# EAGLE design pico_test_w5100s_evb (EAGLE 9.6.2)
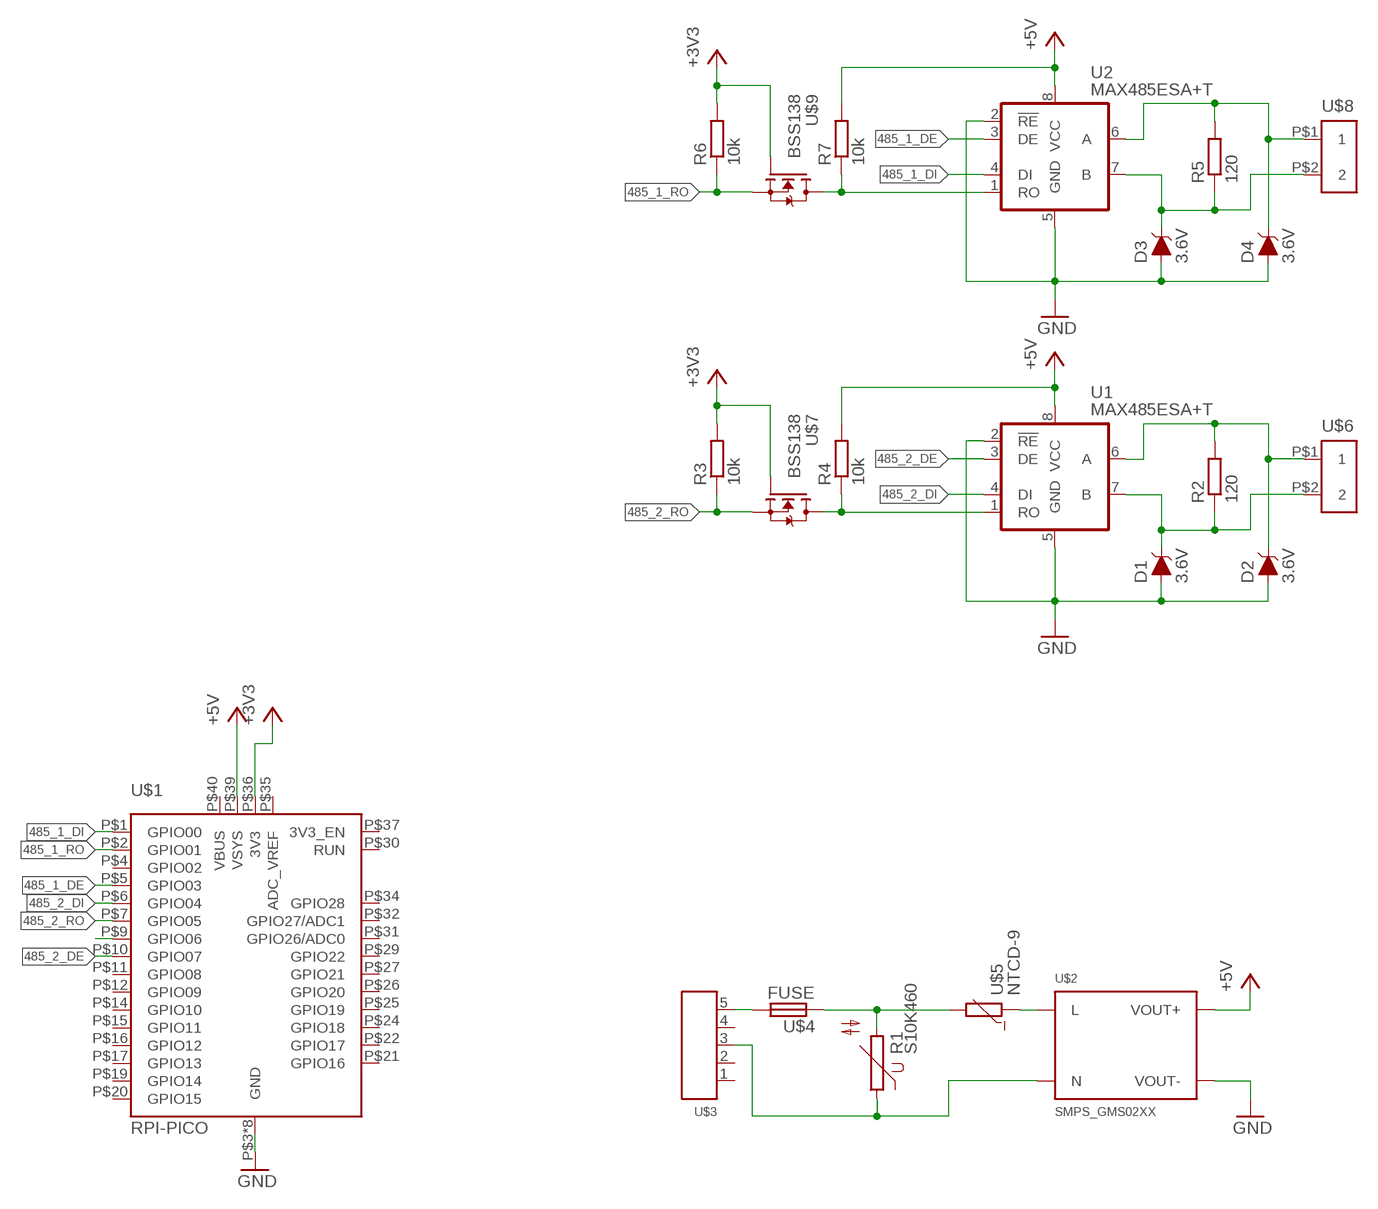
[diagram p0: schematic, sheet 1]

## Parts
D1  3.6V  DIODE-ZENER-BZT52C3V6S  [SOD-323]
D2  3.6V  DIODE-ZENER-BZT52C3V6S  [SOD-323]
D3  3.6V  DIODE-ZENER-BZT52C3V6S  [SOD-323]
D4  3.6V  DIODE-ZENER-BZT52C3V6S  [SOD-323]
R1  S10K460  [S10K460]
R2  120  R-EU_R0603  [R0603]
R3  10k  R-EU_R0603  [R0603]
R4  10k  R-EU_R0603  [R0603]
R5  120  R-EU_R0603  [R0603]
R6  10k  R-EU_R0603  [R0603]
R7  10k  R-EU_R0603  [R0603]
U1  MAX485ESA+T  [SOIC127P600X175-8N]
U2  MAX485ESA+T  [SOIC127P600X175-8N]
U$1  RPI-PICO  [W5100S-EVB-PICO]
U$2  SMPS_GMS02XX  [GMS02XX]
U$3  XEHDR-5  [XEHDR-5]
U$4  FUSE  [FUZEX8.5X4.5X5.08]
U$5  NTCD-9  [NTCXD-9]
U$6  XEHDR-2  [5EHDR-2]
U$7  BSS138  [SOT95P240X110-3N]
U$8  XEHDR-2  [5EHDR-2]
U$9  BSS138  [SOT95P240X110-3N]

## Nets
485_1_DE: U2.3(DE) U$1.P$5(GPIO03)
485_1_DI: U2.4(DI) U$1.P$1(GPIO00)
485_1_RO: R6.1 U$1.P$2(GPIO01) U$9.2(S)
485_2_DE: U1.3(DE) U$1.P$10(GPIO07)
485_2_DI: U1.4(DI) U$1.P$6(GPIO04)
485_2_RO: R3.1 U$1.P$7(GPIO05) U$7.2(S)
+3V3: R3.2 R6.2 U$1.P$36(3V3) U$7.1(G) U$9.1(G)
+5V: R4.2 R7.2 U1.8(VCC) U2.8(VCC) U$1.P$39(VSYS) U$2.DC+(VOUT+)
GND: D1.A D2.A D3.A D4.A U1.2(!RE) U1.5(GND) U2.2(!RE) U2.5(GND) U$1.P$3(GND) U$1.P$8(GND) U$1.P$13(GND) U$1.P$18(GND) U$1.P$23(GND) U$1.P$28(GND) U$1.P$33(GND) U$1.P$38(GND) U$2.DC-(VOUT-)
N$1: U$3.5 U$4.P$2
N$2: R1.2 U$4.P$1 U$5.P$2
N$3: U$2.P$1(L) U$5.P$1
N$4: R1.1 U$2.P$2(N) U$3.3
N$5: R4.1 U1.1(RO) U$7.3(D)
N$6: D1.C R2.1 U1.7(B) U$6.P$2
N$7: D2.C R2.2 U1.6(A) U$6.P$1
N$10: D3.C R5.1 U2.7(B) U$8.P$2
N$11: D4.C R5.2 U2.6(A) U$8.P$1
N$15: U$1.P$9(GPIO06)
N$17: R7.1 U2.1(RO) U$9.3(D)
Unconnected: U$1.P$4(GPIO02) U$1.P$11(GPIO08) U$1.P$12(GPIO09) U$1.P$14(GPIO10) U$1.P$15(GPIO11) U$1.P$16(GPIO12) U$1.P$17(GPIO13) U$1.P$19(GPIO14) U$1.P$20(GPIO15) U$1.P$21(GPIO16) U$1.P$22(GPIO17) U$1.P$24(GPIO18) U$1.P$25(GPIO19) U$1.P$26(GPIO20) U$1.P$27(GPIO21) U$1.P$29(GPIO22) U$1.P$30(RUN) U$1.P$31(GPIO26/ADC0) U$1.P$32(GPIO27/ADC1) U$1.P$34(GPIO28) U$1.P$35(ADC_VREF) U$1.P$37(3V3_EN) U$1.P$40(VBUS) U$3.1 U$3.2 U$3.4

## Library data of the parts
D1-D4 = picoRS485Gateway:DIODE-ZENER: Zener Diode A Zener diode allows current to flow from its anode to its cathode like a normal semiconductor diode, but it also permits current to flow in the reverse direction when its "Zener voltage" is reached. - WIkipedia; PROD_ID: DIO-08199
R1 = picoRS485Gateway:S10K460: VARISTOR
R2-R7 = rcl:R-EU_: RESISTOR, European symbol; SPICEPREFIX: R
U1 U2 = picoRS485Gateway:MAX485ESA+T: Check prices <https://pricing.snapeda.com/parts/MAX485ESA%2BT/Maxim%20Integrated/view-part?ref=eda>; AVAILABILITY: Not in stock; DESCRIPTION: 1/1 Transceiver Half RS422, RS485 8-SOIC; MF: Maxim Integrated; MP: MAX485ESA+T; PACKAGE: SOIC-8 Maxim; PRICE: None
U$1 = picoRS485Gateway:RPI-PICO
U$2 = picoRS485Gateway:SMPS_GMS
U$3 = picoRS485Gateway:XEHDR-5
U$4 = picoRS485Gateway:FUSE
U$5 = picoRS485Gateway:NTC
U$6 U$8 = picoRS485Gateway:XEHDR-2
U$7 U$9 = picoRS485Gateway:BSS138

## Board
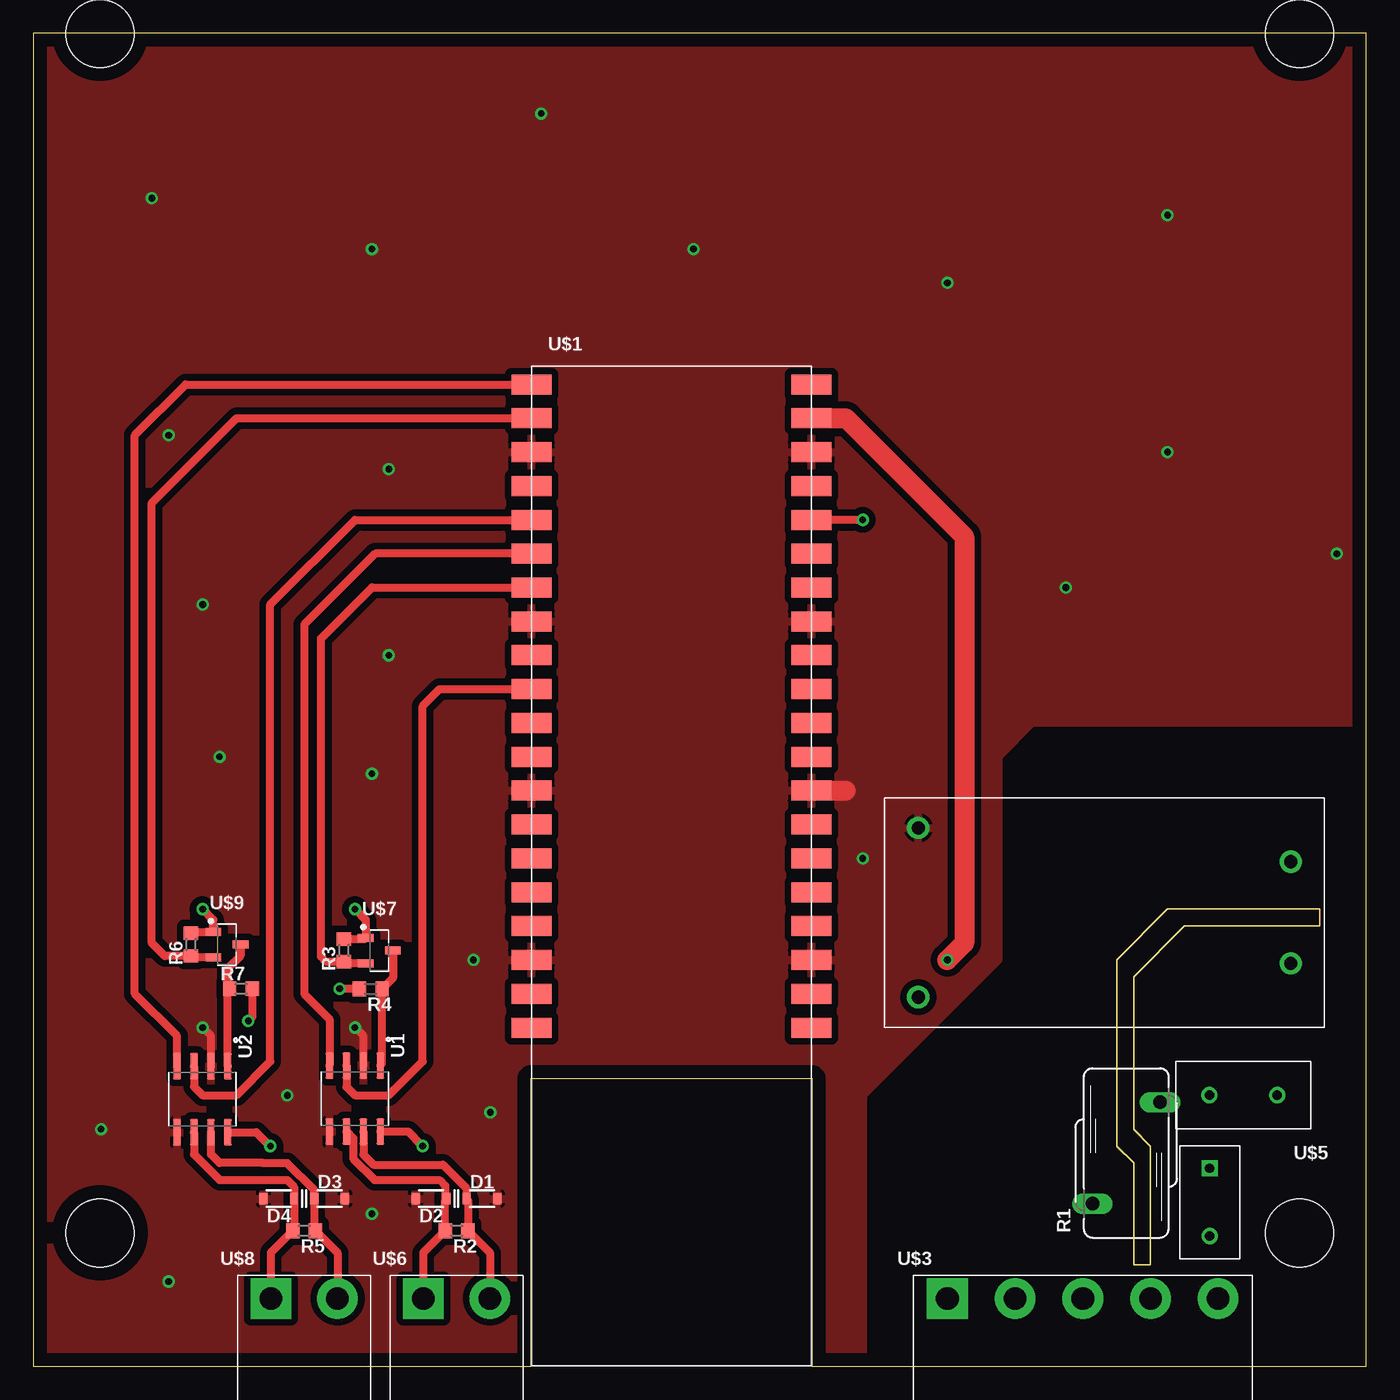
[diagram p1: board, top side]
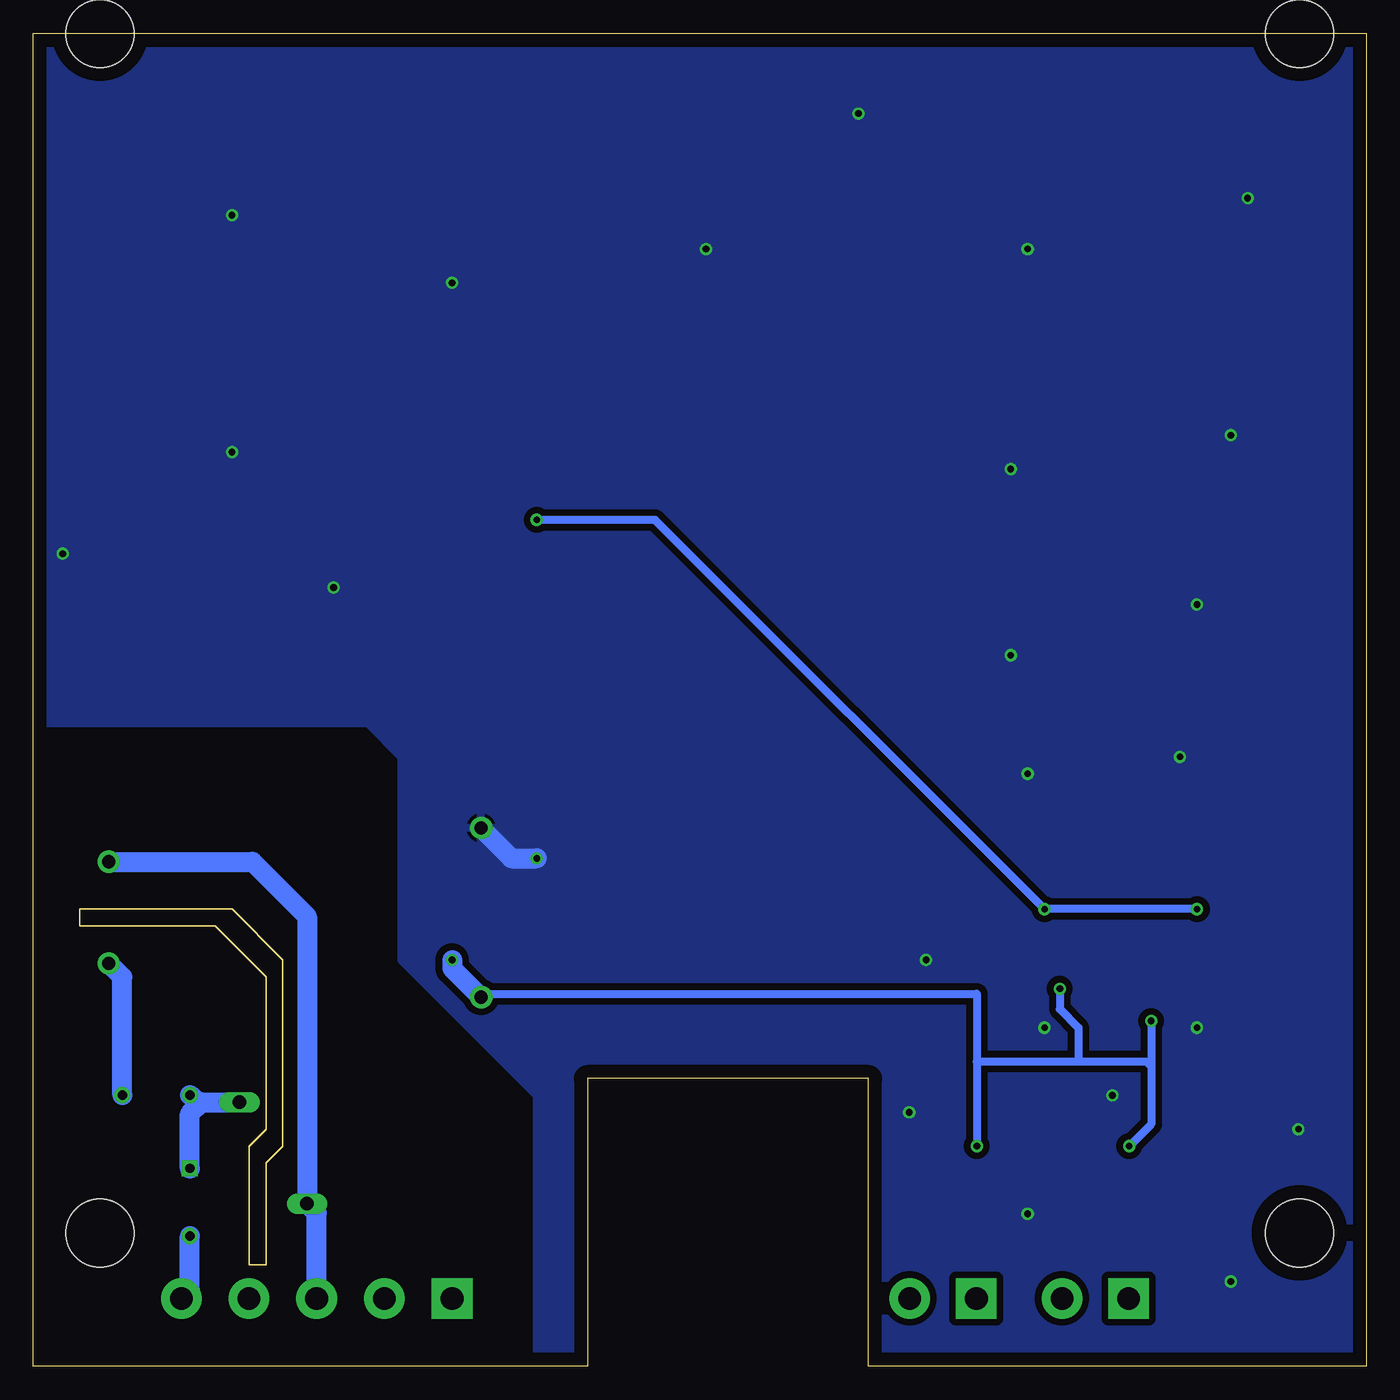
[diagram p2: board, bottom side, seen from below]

Size 100 x 100 mm. Coordinates in mm from the lower left corner, seen from the top.
Outline: 0,0 37.34,0 37.34,21.59 58.42,21.59 58.42,0 100,0 100,100 0,100 0,0
Copper layers (1*16): Top 0.035mm / dielectric 0.15mm / Bottom 0.035mm
Design rules "default": minimum track width 6mil, minimum drill 0.35mm, track to track 6mil, track to pad 6mil, pad to pad 6mil, via to via 6mil, smd to smd 6mil, copper to edge 40mil, drill to drill 6mil, minimum pad ring 10mil, minimum via ring 8mil, stop-mask expansion 4mil, vias tented up to drill 0mil, thermal gap 10mil
Holes 5.1 mm at 5,10 95,10 95,100 5,100
Milling: 12 lines

### Footprints (pad centres in the part's own frame; a part is rotated, then mirrored left to right if it is on the bottom)
SOD-323 = smd 0.63 x 0.83: A 1.15,0; C -1.15,0
S10K460 = drill 1.016 long: 1 -2.54,-3.81; 2 2.54,3.81
R0603 = smd 1 x 1.1: 1 -0.85,0; 2 0.85,0
SOIC127P600X175-8N = smd 1.97 x 0.59: 1 -2.475,1.905; 2 -2.475,0.635; 3 -2.475,-0.635; 4 -2.475,-1.905; 5 2.475,-1.905; 6 2.475,-0.635; 7 2.475,0.635; 8 2.475,1.905
W5100S-EVB-PICO = smd 1.5 x 3: P$1 0,0; P$2 2.54,0; P$3 5.08,0; P$4 7.62,0; P$5 10.16,0; P$6 12.7,0; P$7 15.24,0; P$8 17.78,0; P$9 20.32,0; P$10 22.86,0; P$11 25.4,0; P$12 27.94,0; P$13 30.48,0; P$14 33.02,0; P$15 35.56,0; P$16 38.1,0; P$17 40.64,0; P$18 43.18,0; P$19 45.72,0; P$20 48.26,0; P$21 48.26,21; P$22 45.72,21; P$23 43.18,21; P$24 40.64,21; P$25 38.1,21; P$26 35.56,21; P$27 33.02,21; P$28 30.48,21; P$29 27.94,21; P$30 25.4,21; P$31 22.86,21; P$32 20.32,21; P$33 17.78,21; P$34 15.24,21; P$35 12.7,21; P$36 10.16,21; P$37 7.62,21; P$38 5.08,21; P$39 2.54,21; P$40 0,21
GMS02XX = drill 1 pad 1.676: DC+ 30.47,14.95; DC- 30.47,2.25; P$1 2.53,12.41; P$2 2.53,4.79
XEHDR-5 = drill 1.7 pad 3.048 square: 1 -10.16,5.08 | drill 1.7 pad 3.048: 2 -5.08,5.08; 3 0,5.08; 4 5.08,5.08; 5 10.16,5.08
FUZEX8.5X4.5X5.08 = drill 0.7 square: P$1 -2.54,0 | drill 0.7: P$2 2.54,0
NTCXD-9 = drill 0.7: P$1 -2.54,0; P$2 2.54,0
5EHDR-2 = drill 1.7 pad 3.048 square: P$1 -2.5,0 | drill 1.7 pad 3.048: P$2 2.5,0
SOT95P240X110-3N = smd 1.18 x 0.609: 1 -1.024,0.95; 2 -1.024,-0.95; 3 1.024,0

### Placement (x,y rotation side)
D1  33.66,12.57 0 top
D2  29.84,12.57 180 top
D3  22.23,12.57 0 top
D4  18.41,12.57 180 top
R1  82,16 0 top
R2  31.75,10.16 180 top
R3  23.3,31.2 90 top
R4  25.32,28.3 180 top
R5  20.32,10.16 180 top
R6  11.84,31.63 90 top
R7  15.58,28.31 0 top
U1  24.13,20.08 270 top
U2  12.69,20.03 270 top
U$1  37.37,73.66 270 top
U$2  96.87,42.63 180 top
U$3  78.74,0 0 top
U$4  88.26,12.3 270 top
U$5  90.78,20.34 180 top
U$6  31.75,5.08 0 top
U$7  25.96,31.18 0 top
U$8  20.32,5.08 0 top
U$9  14.53,31.63 0 top

### Tracks (layer width: path | path; a pad name or v marks a point on that pad's centre or on a via)
485_1_DE
  Top 0.61: U2.3 12.05,20.96 12.7,20.32 15.24,20.32 17.78,22.86 17.78,57.15 24.13,63.5 U$1.P$5
485_1_DI
  Top 0.61: U$1.P$1 11.43,73.66 7.62,69.85 7.62,27.94 10.79,24.77 U2.4
485_1_RO
  Top 0.61: U$9.2 11.93,30.68 R6.1 9.86,30.78 8.89,31.75 8.89,64.77 15.24,71.12 U$1.P$2
485_2_DE
  Top 0.61: U1.3 23.5,20.95 24.13,20.32 26.67,20.32 29.21,22.86 29.21,49.53 30.48,50.8 U$1.P$10
485_2_DI
  Top 0.61: U$1.P$6 25.65,60.96 20.32,55.63 20.32,27.94 22.23,26.04 U1.4
485_2_RO
  Top 0.61: U$7.2 23.42,30.23 R3.1 21.98,30.35 21.59,30.73 21.59,54.61 25.4,58.42 U$1.P$7
+3V3  (via drill 0.5)
  Top 0.61: 23.38,32.13 R3.2 24.86,32.05 U$7.1 24.94,33.48 v24.13,34.29 | R6.2 11.94,32.58 U$9.1 13.51,33.48 v12.7,34.29 | v62.23,63.5 U$1.P$36
  Bottom 0.61: v12.7,34.29 v24.13,34.29 53.34,63.5 v62.23,63.5
+5V  (via drill 0.5)
  Top 0.61: U2.8 16.73,17.55 v17.78,16.51 | R7.2 16.43,26.21 v16.13,25.91 | R4.2 23.01,28.3 v22.99,28.32 | U1.8 28.11,17.61 v29.21,16.51
  Top 1.5: U$1.P$39 60.96,71.12 69.85,62.23 69.85,31.75 v68.58,30.48
  Bottom 0.61: U$2.DC+ 66.14,27.94 29.21,27.94 29.21,22.86 | 29.21,22.86 21.59,22.86 | 21.59,22.86 16.51,22.86 16.13,22.48 | 16.13,22.48 16.13,18.16 v17.78,16.51 | v16.13,25.91 16.13,22.48 | v22.99,28.32 22.99,26.8 21.59,25.4 21.59,22.86 | 29.21,22.86 v29.21,16.51
  Bottom 1.5: v68.58,30.48 68.58,29.86 U$2.DC+
GND  (via drill 0.5)
  Top 0.61: U2.2 13.32,24.77 v12.7,25.4 | U1.2 24.77,24.77 v24.13,25.4
  Top 1.5: U$1.P$28 60.96,43.18 | 36.83,43.18 U$1.P$13
  Bottom 1.5: U$2.DC- 64.12,38.1 v62.23,38.1
  other vias: 25.4,83.82 49.53,83.82 68.58,81.28 77.47,58.42 26.67,53.34 26.67,67.31 12.7,57.15 5.08,17.78 10.16,6.35 85.09,86.36 97.79,60.96 85.09,68.58 38.1,93.98 8.89,87.63 25.4,44.45 13.97,45.72 19.05,20.32 25.4,11.43 34.29,19.05 33.02,30.48 10.16,69.85
  pour Top (isolate 0.5, rank 2): 72.39,45.72 72.39,30.48 62.23,20.32 62.23,-1.27 -2.54,-1.27 -2.54,100.33 100.33,100.33 100.33,48.26 74.93,48.26
  pour Bottom (isolate 0.5): -3.81,-2.54 -3.81,101.6 101.6,101.6 101.6,48.26 74.93,48.26 72.39,45.72 72.39,30.48 62.23,20.32 62.23,-2.54
N$1
  Bottom 1.5: U$3.5 88.26,5.72 U$4.P$2
N$2
  Bottom 1.5: U$4.P$1 88.26,18.93 87.38,19.81 | 87.38,19.81 R1.2 | U$5.P$2 87.71,19.81 87.38,19.81
N$3
  Bottom 1.5: U$5.P$1 93.32,29.2 U$2.P$1
N$4
  Bottom 1.5: U$3.3 78.74,11.47 R1.1 79.46,33.74 83.56,37.84 U$2.P$2
N$5
  Top 0.61: U1.1 26.17,22.69 R4.1 26.98,29.12 U$7.3
N$6
  Top 0.61: U$6.P$2 34.25,8.51 R2.1 32.6,12.48 D1.C 32.51,13.34 30.73,15.11 25.53,15.11 24.77,15.88 U1.7
N$7
  Top 0.61: U$6.P$1 29.25,8.51 R2.2 30.9,12.48 | 30.9,12.48 D2.C | U1.6 24,17.1 24,15.56 25.59,13.97 30.48,13.97 30.9,13.55 30.9,12.48
N$10
  Top 0.61: U$8.P$2 22.82,8.51 R5.1 21.07,10.26 D3.C 21.07,13.21 19.06,15.23 17.25,15.23 17.24,15.24 13.97,15.24 13.32,15.88 U2.7
N$11
  Top 0.61: U$8.P$1 17.82,8.51 R5.2 19.57,10.26 D4.C 19.57,13.46 19.05,13.97 13.97,13.97 12.05,15.88 U2.6
N$17
  Top 0.61: U$9.3 15.55,30.79 14.6,29.84 14.6,28.18 | U2.1 14.6,28.18 | 14.6,28.18 R7.1